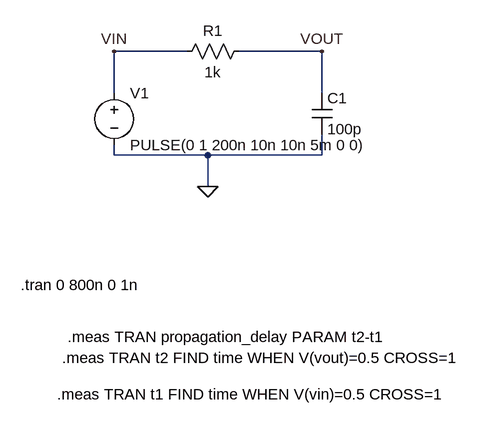
[diagram p0: schematic lab00_simple_rc.asc]
lab00_simple_rc.asc, the LTspice schematic file:
Version 4
SHEET 1 880 680
WIRE 176 112 64 112
WIRE 384 112 256 112
WIRE 64 176 64 112
WIRE 384 176 384 112
WIRE 64 272 64 256
WIRE 208 272 64 272
WIRE 384 272 384 240
WIRE 384 272 208 272
WIRE 208 320 208 272
FLAG 208 320 0
FLAG 64 112 VIN
FLAG 384 112 VOUT
SYMBOL res 160 128 R270
WINDOW 0 32 56 VTop 2
WINDOW 3 0 56 VBottom 2
SYMATTR InstName R1
SYMATTR Value 1k
SYMBOL cap 368 176 R0
SYMATTR InstName C1
SYMATTR Value 100p
SYMBOL voltage 64 160 R0
WINDOW 123 0 0 Left 0
WINDOW 39 0 0 Left 0
SYMATTR InstName V1
SYMATTR Value PULSE(0 1 200n 10n 10n 5m 0 0)
TEXT -80 472 Left 2 !.tran 0 800n 0 1n
TEXT -24 640 Left 2 !.meas TRAN t1 FIND time WHEN V(vin)=0.5 CROSS=1
TEXT -16 584 Left 2 !.meas TRAN t2 FIND time WHEN V(vout)=0.5 CROSS=1
TEXT -8 552 Left 2 !.meas TRAN propagation_delay PARAM t2-t1

The netlist it stands for:
* lab00_simple_rc.asc
R1 VIN VOUT 1k
C1 VOUT 0 100p
V1 VIN 0 PULSE(0 1 200n 10n 10n 5m 0 0)
.tran 0 800n 0 1n
.meas TRAN t1 FIND time WHEN V(vin)=0.5 CROSS=1
.meas TRAN t2 FIND time WHEN V(vout)=0.5 CROSS=1
.meas TRAN propagation_delay PARAM t2-t1
.backanno
.end